# EAGLE design Expander (EAGLE 5.09)
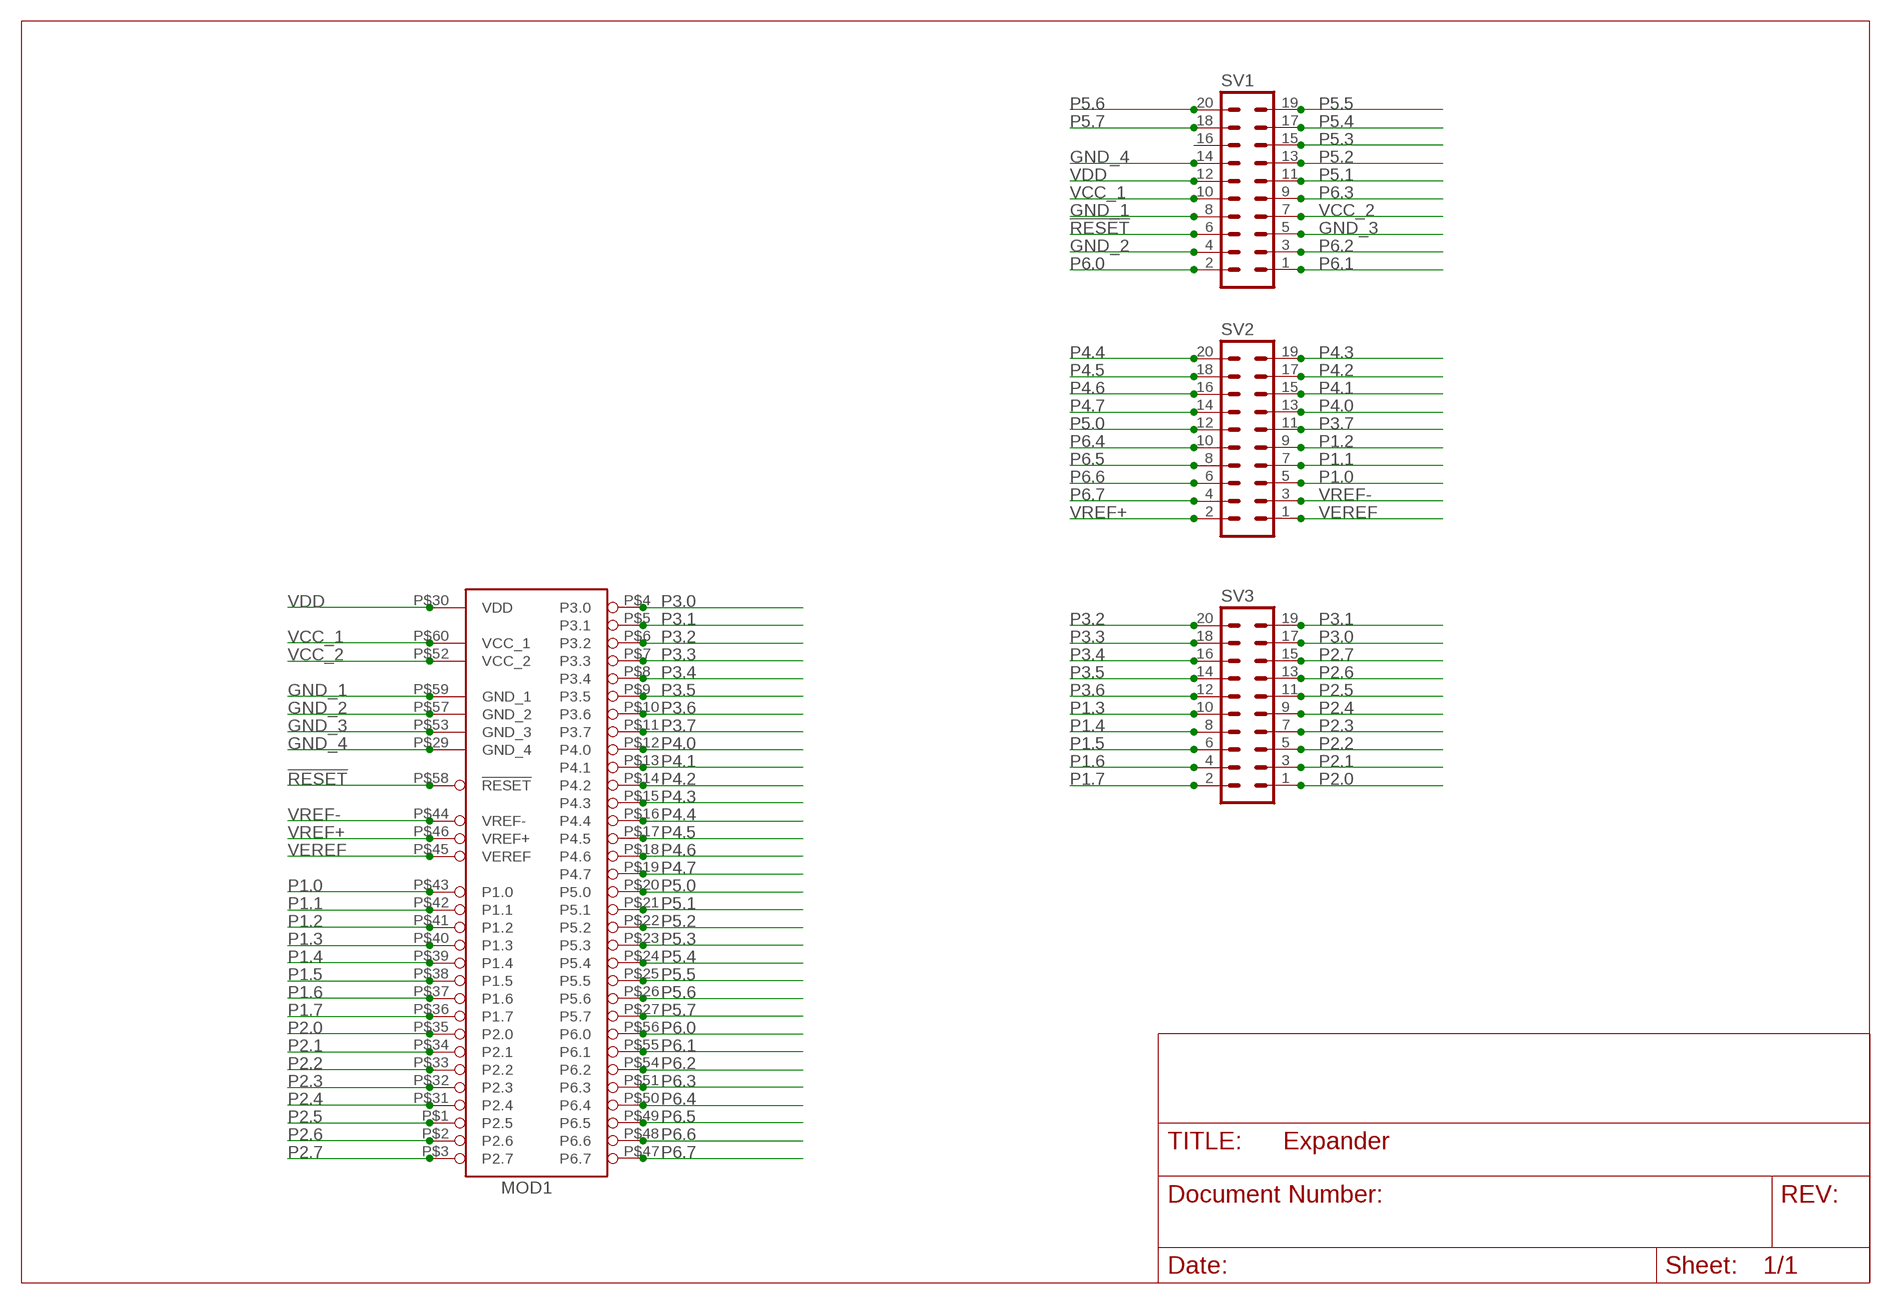
[diagram p0: schematic, sheet 1]

## Parts
MOD1  MOD_MSP430F16X  [MOD_MSDP430F16X]
SV1  ML20  [ML20]
SV2  ML20  [ML20]
SV3  ML20  [ML20]

## Nets
!RESET: MOD1.P$58(!RESET) SV1.6
GND_1: MOD1.P$59(GND_1) SV1.8
GND_2: MOD1.P$57(GND_2) SV1.4
GND_3: MOD1.P$53(GND_3) SV1.5
GND_4: MOD1.P$29(GND_4) SV1.14
P1.0: MOD1.P$43(P1.0) SV2.5
P1.1: MOD1.P$42(P1.1) SV2.7
P1.2: MOD1.P$41(P1.2) SV2.9
P1.3: MOD1.P$40(P1.3) SV3.10
P1.4: MOD1.P$39(P1.4) SV3.8
P1.5: MOD1.P$38(P1.5) SV3.6
P1.6: MOD1.P$37(P1.6) SV3.4
P1.7: MOD1.P$36(P1.7) SV3.2
P2.0: MOD1.P$35(P2.0) SV3.1
P2.1: MOD1.P$34(P2.1) SV3.3
P2.2: MOD1.P$33(P2.2) SV3.5
P2.3: MOD1.P$32(P2.3) SV3.7
P2.4: MOD1.P$31(P2.4) SV3.9
P2.5: MOD1.P$1(P2.5) SV3.11
P2.6: MOD1.P$2(P2.6) SV3.13
P2.7: MOD1.P$3(P2.7) SV3.15
P3.0: MOD1.P$4(P3.0) SV3.17
P3.1: MOD1.P$5(P3.1) SV3.19
P3.2: MOD1.P$6(P3.2) SV3.20
P3.3: MOD1.P$7(P3.3) SV3.18
P3.4: MOD1.P$8(P3.4) SV3.16
P3.5: MOD1.P$9(P3.5) SV3.14
P3.6: MOD1.P$10(P3.6) SV3.12
P3.7: MOD1.P$11(P3.7) SV2.11
P4.0: MOD1.P$12(P4.0) SV2.13
P4.1: MOD1.P$13(P4.1) SV2.15
P4.2: MOD1.P$14(P4.2) SV2.17
P4.3: MOD1.P$15(P4.3) SV2.19
P4.4: MOD1.P$16(P4.4) SV2.20
P4.5: MOD1.P$17(P4.5) SV2.18
P4.6: MOD1.P$18(P4.6) SV2.16
P4.7: MOD1.P$19(P4.7) SV2.14
P5.0: MOD1.P$20(P5.0) SV2.12
P5.1: MOD1.P$21(P5.1) SV1.11
P5.2: MOD1.P$22(P5.2) SV1.13
P5.3: MOD1.P$23(P5.3) SV1.15
P5.4: MOD1.P$24(P5.4) SV1.17
P5.5: MOD1.P$25(P5.5) SV1.19
P5.6: MOD1.P$26(P5.6) SV1.20
P5.7: MOD1.P$27(P5.7) SV1.18
P6.0: MOD1.P$56(P6.0) SV1.2
P6.1: MOD1.P$55(P6.1) SV1.1
P6.2: MOD1.P$54(P6.2) SV1.3
P6.3: MOD1.P$51(P6.3) SV1.9
P6.4: MOD1.P$50(P6.4) SV2.10
P6.5: MOD1.P$49(P6.5) SV2.8
P6.6: MOD1.P$48(P6.6) SV2.6
P6.7: MOD1.P$47(P6.7) SV2.4
VCC_1: MOD1.P$60(VCC_1) SV1.10
VCC_2: MOD1.P$52(VCC_2) SV1.7
VDD: MOD1.P$30(VDD) SV1.12
VEREF: MOD1.P$45(VEREF) SV2.1
VREF+: MOD1.P$46(VREF+) SV2.2
VREF-: MOD1.P$44(VREF-) SV2.3
Unconnected: SV1.16

## Library data of the parts
MOD1 = extra_dev:MOD_MSP430F16X
SV1-SV3 = con-harting-ml:ML20: HARTING

## Board
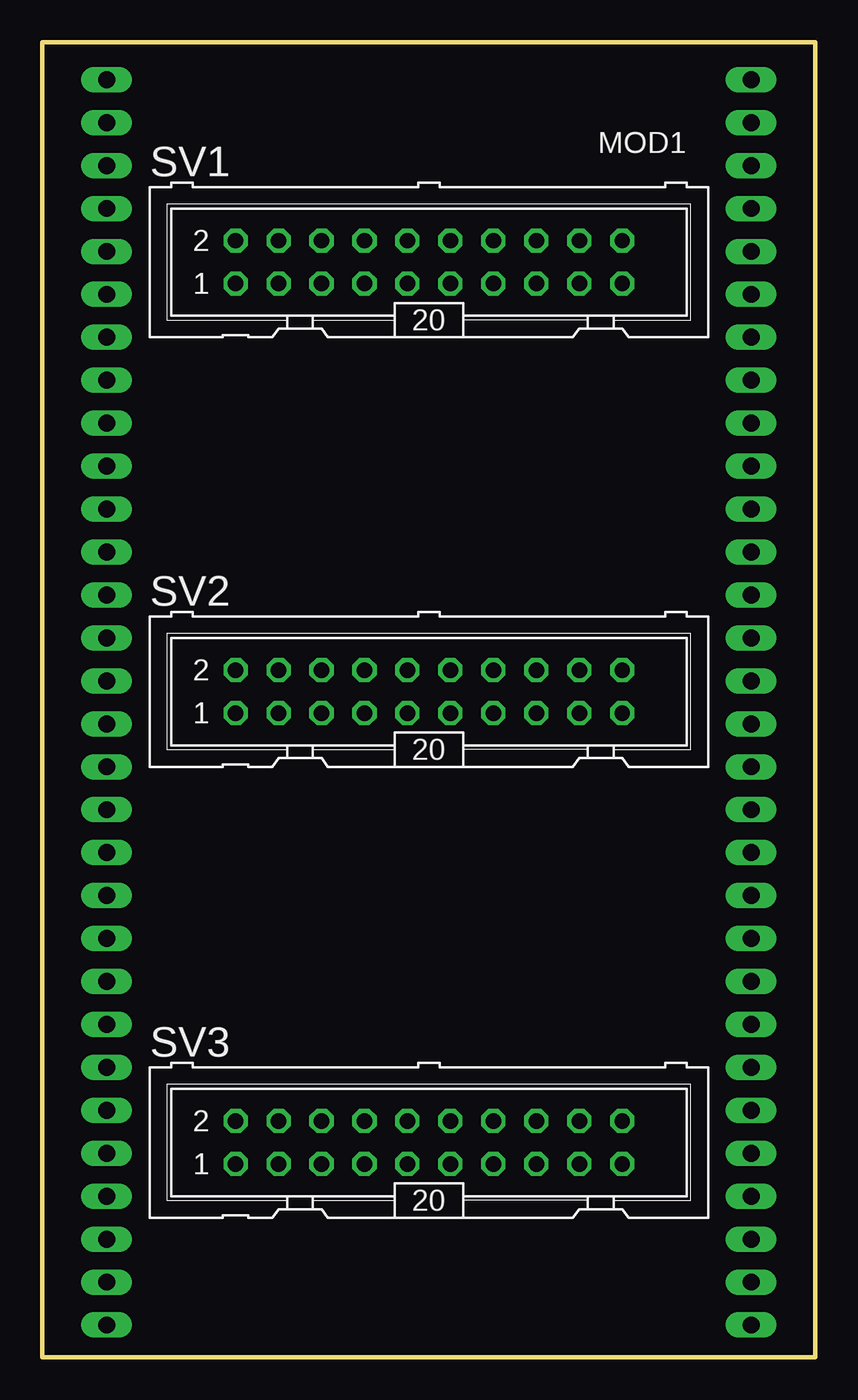
[diagram p1: board, top side]
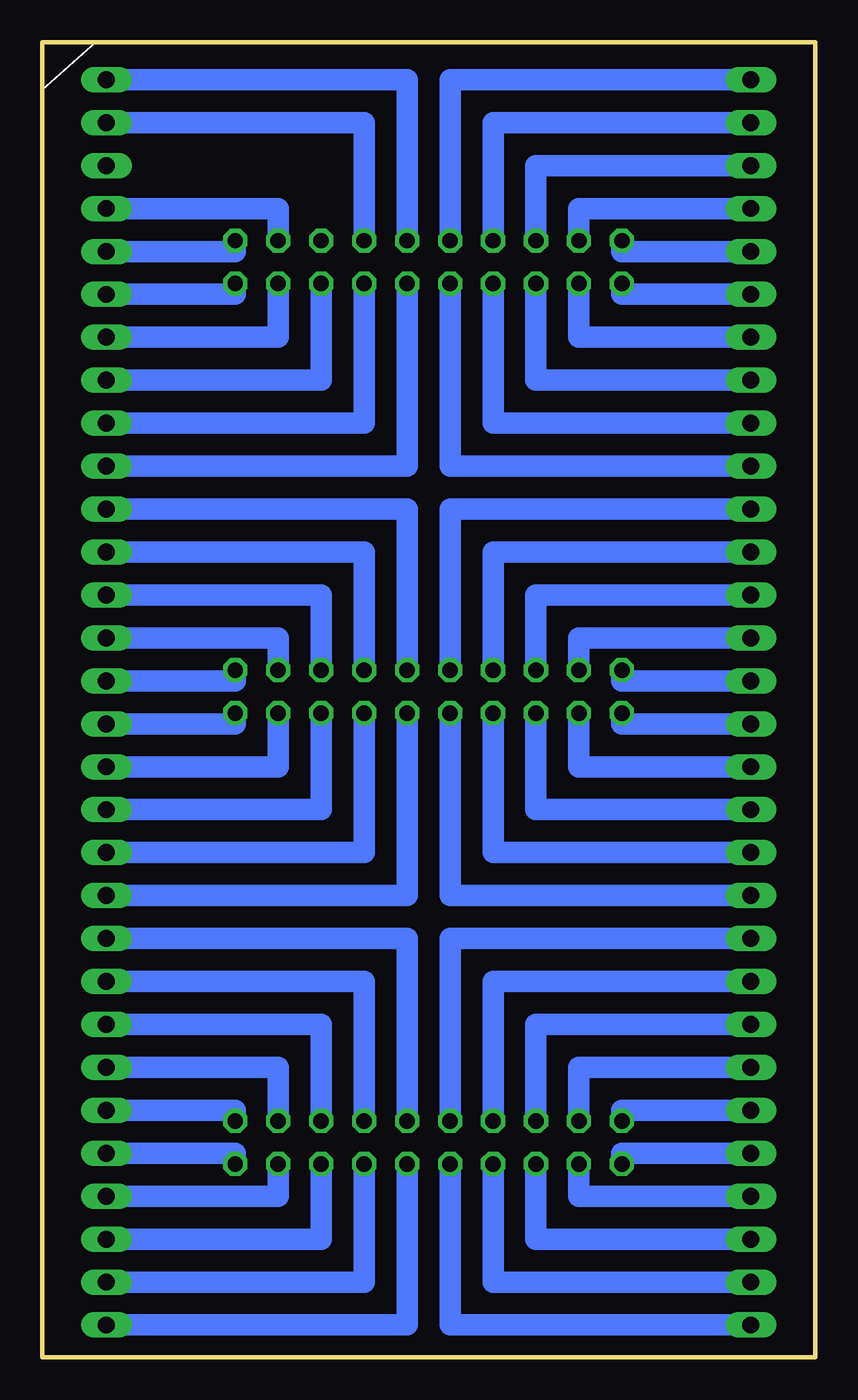
[diagram p2: board, bottom side, seen from below]

Size 45.7 x 77.78 mm. Coordinates in mm from the lower left corner, seen from the top.
Outline: 0,0 45.7,0 45.7,77.78 0,77.78 0,0
Copper layers (1*16): Top 0.035mm / dielectric 1.5mm / Bottom 0.035mm
Design rules "default": minimum track width 10mil, minimum drill 24mil, track to track 8mil, track to pad 8mil, pad to pad 8mil, via to via 8mil, smd to smd 8mil, copper to edge 40mil, drill to drill 8mil, minimum pad ring 10mil, minimum via ring 8mil, stop-mask expansion 4mil, vias tented up to drill 0mil, thermal gap 10mil

### Footprints (pad centres in the part's own frame; a part is rotated, then mirrored left to right if it is on the bottom)
MOD_MSDP430F16X = drill 1 pad 1.422 long: P$1 41.91,1.905; P$2 41.91,4.445; P$3 41.91,6.985; P$4 41.91,9.525; P$5 41.91,12.065; P$6 41.91,14.605; P$7 41.91,17.145; P$8 41.91,19.685; P$9 41.91,22.225; P$10 41.91,24.765; P$11 41.91,27.305; P$12 41.91,29.845; P$13 41.91,32.385; P$14 41.91,34.925; P$15 41.91,37.465; P$16 41.91,40.005; P$17 41.91,42.545; P$18 41.91,45.085; P$19 41.91,47.625; P$20 41.91,50.165; P$21 41.91,52.705; P$22 41.91,55.245; P$23 41.91,57.785; P$24 41.91,60.325; P$25 41.91,62.865; P$26 41.91,65.405; P$27 41.91,67.945; P$28 41.91,70.485; P$29 41.91,73.025; P$30 41.91,75.565; P$31 3.81,1.905; P$32 3.81,4.445; P$33 3.81,6.985; P$34 3.81,9.525; P$35 3.81,12.065; P$36 3.81,14.605; P$37 3.81,17.145; P$38 3.81,19.685; P$39 3.81,22.225; P$40 3.81,24.765; P$41 3.81,27.305; P$42 3.81,29.845; P$43 3.81,32.385; P$44 3.81,34.925; P$45 3.81,37.465; P$46 3.81,40.005; P$47 3.81,42.545; P$48 3.81,45.085; P$49 3.81,47.625; P$50 3.81,50.165; P$51 3.81,52.705; P$52 3.81,55.245; P$53 3.81,57.785; P$54 3.81,60.325; P$55 3.81,62.865; P$56 3.81,65.405; P$57 3.81,67.945; P$58 3.81,70.485; P$59 3.81,73.025; P$60 3.81,75.565
ML20 = drill 0.914 octagon: 1 -11.43,-1.27; 2 -11.43,1.27; 3 -8.89,-1.27; 4 -8.89,1.27; 5 -6.35,-1.27; 6 -6.35,1.27; 7 -3.81,-1.27; 8 -3.81,1.27; 9 -1.27,-1.27; 10 -1.27,1.27; 11 1.27,-1.27; 12 1.27,1.27; 13 3.81,-1.27; 14 3.81,1.27; 15 6.35,-1.27; 16 6.35,1.27; 17 8.89,-1.27; 18 8.89,1.27; 19 11.43,-1.27; 20 11.43,1.27

### Placement (x,y rotation side)
MOD1  0,0 0 top
SV1  22.86,64.77 0 top
SV2  22.86,39.37 0 top
SV3  22.86,12.7 0 top

### Tracks (layer width: path | path; a pad name or v marks a point on that pad's centre or on a via)
!RESET
  Bottom 1.27: MOD1.P$58 16.51,70.48 SV1.6
GND_1
  Bottom 1.27: MOD1.P$59 19.05,73.03 SV1.8
GND_2
  Bottom 1.27: MOD1.P$57 13.97,67.94 SV1.4
GND_3
  Bottom 1.27: SV1.5 16.51,57.78 MOD1.P$53
GND_4
  Bottom 1.27: SV1.14 26.67,73.03 MOD1.P$29
P1.0
  Bottom 1.27: SV2.5 16.51,32.38 MOD1.P$43
P1.1
  Bottom 1.27: SV2.7 19.05,29.84 MOD1.P$42
P1.2
  Bottom 1.27: SV2.9 21.59,27.3 MOD1.P$41
P1.3
  Bottom 1.27: MOD1.P$40 21.59,24.77 SV3.10
P1.4
  Bottom 1.27: MOD1.P$39 19.05,22.23 SV3.8
P1.5
  Bottom 1.27: MOD1.P$38 16.51,19.68 SV3.6
P1.6
  Bottom 1.27: MOD1.P$37 13.97,17.14 SV3.4
P1.7
  Bottom 1.27: MOD1.P$36 11.43,14.61 SV3.2
P2.0
  Bottom 1.27: MOD1.P$35 11.43,12.06 SV3.1
P2.1
  Bottom 1.27: MOD1.P$34 13.97,9.53 SV3.3
P2.2
  Bottom 1.27: MOD1.P$33 16.51,6.99 SV3.5
P2.3
  Bottom 1.27: MOD1.P$32 19.05,4.45 SV3.7
P2.4
  Bottom 1.27: MOD1.P$31 21.59,1.91 SV3.9
P2.5
  Bottom 1.27: MOD1.P$1 24.13,1.91 SV3.11
P2.6
  Bottom 1.27: MOD1.P$2 26.67,4.45 SV3.13
P2.7
  Bottom 1.27: MOD1.P$3 29.21,6.99 SV3.15
P3.0
  Bottom 1.27: MOD1.P$4 31.75,9.53 SV3.17
P3.1
  Bottom 1.27: MOD1.P$5 34.29,12.06 SV3.19
P3.2
  Bottom 1.27: MOD1.P$6 34.29,14.61 SV3.20
P3.3
  Bottom 1.27: MOD1.P$7 31.75,17.14 SV3.18
P3.4
  Bottom 1.27: MOD1.P$8 29.21,19.68 SV3.16
P3.5
  Bottom 1.27: MOD1.P$9 26.67,22.23 SV3.14
P3.6
  Bottom 1.27: MOD1.P$10 24.13,24.77 SV3.12
P3.7
  Bottom 1.27: SV2.11 24.13,27.3 MOD1.P$11
P4.0
  Bottom 1.27: SV2.13 26.67,29.84 MOD1.P$12
P4.1
  Bottom 1.27: SV2.15 29.21,32.38 MOD1.P$13
P4.2
  Bottom 1.27: SV2.17 31.75,34.92 MOD1.P$14
P4.3
  Bottom 1.27: SV2.19 34.29,37.47 MOD1.P$15
P4.4
  Bottom 1.27: MOD1.P$16 34.29,40.01 SV2.20
P4.5
  Bottom 1.27: SV2.18 31.75,42.55 MOD1.P$17
P4.6
  Bottom 1.27: SV2.16 29.21,45.09 MOD1.P$18
P4.7
  Bottom 1.27: SV2.14 26.67,47.62 MOD1.P$19
P5.0
  Bottom 1.27: SV2.12 24.13,50.16 MOD1.P$20
P5.1
  Bottom 1.27: SV1.11 24.13,52.7 MOD1.P$21
P5.2
  Bottom 1.27: SV1.13 26.67,55.24 MOD1.P$22
P5.3
  Bottom 1.27: SV1.15 29.21,57.78 MOD1.P$23
P5.4
  Bottom 1.27: SV1.17 31.75,60.33 MOD1.P$24
P5.5
  Bottom 1.27: SV1.19 34.29,62.87 MOD1.P$25
P5.6
  Bottom 1.27: MOD1.P$26 34.29,65.41 SV1.20
P5.7
  Bottom 1.27: SV1.18 31.75,67.94 MOD1.P$27
P6.0
  Bottom 1.27: MOD1.P$56 11.43,65.41 SV1.2
P6.1
  Bottom 1.27: SV1.1 11.43,62.87 MOD1.P$55
P6.2
  Bottom 1.27: SV1.3 13.97,60.33 MOD1.P$54
P6.3
  Bottom 1.27: SV1.9 21.59,52.7 MOD1.P$51
P6.4
  Bottom 1.27: SV2.10 21.59,50.16 MOD1.P$50
P6.5
  Bottom 1.27: SV2.8 19.05,47.62 MOD1.P$49
P6.6
  Bottom 1.27: SV2.6 16.51,45.09 MOD1.P$48
P6.7
  Bottom 1.27: SV2.4 13.97,42.55 MOD1.P$47
VCC_1
  Bottom 1.27: MOD1.P$60 21.59,75.56 SV1.10
VCC_2
  Bottom 1.27: SV1.7 19.05,55.24 MOD1.P$52
VDD
  Bottom 1.27: MOD1.P$30 24.13,75.56 SV1.12
VEREF
  Bottom 1.27: SV2.1 11.43,37.47 MOD1.P$45
VREF+
  Bottom 1.27: MOD1.P$46 11.43,40.01 SV2.2
VREF-
  Bottom 1.27: SV2.3 13.97,34.92 MOD1.P$44